# EAGLE design MetronomeSMD (EAGLE 6.1)
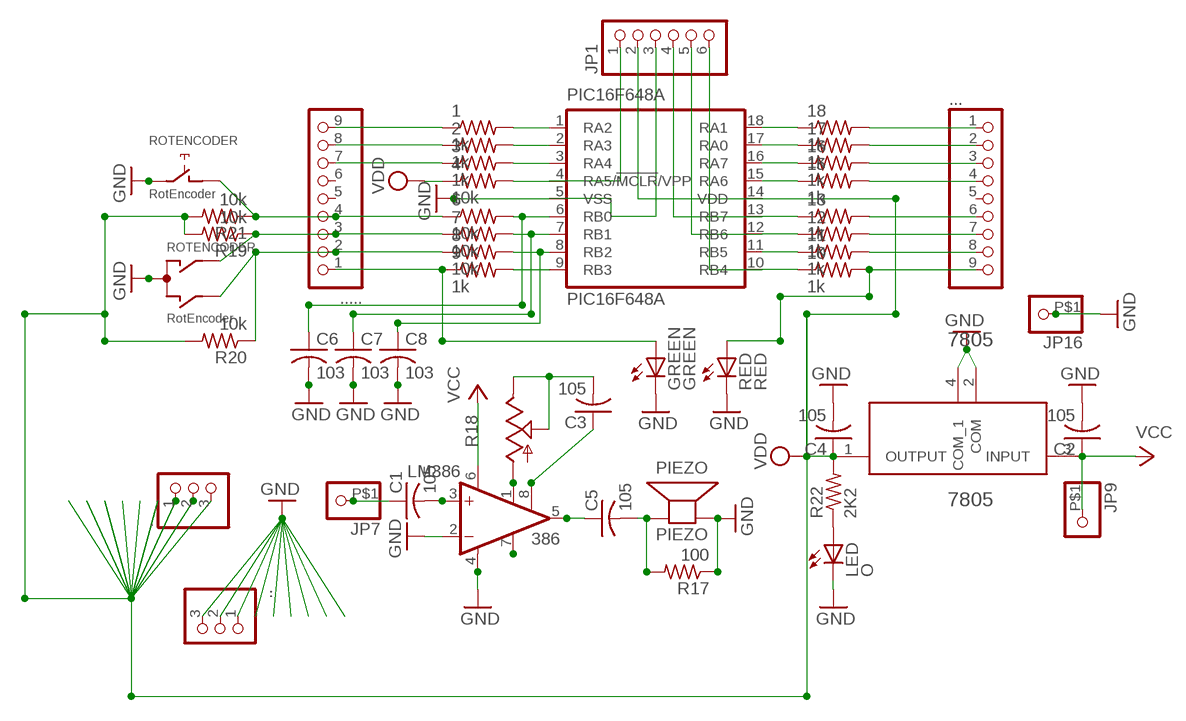
[diagram p0: schematic, sheet 1]

## Parts
1  1k  R-US_R1206  [R1206]
2  1k  R-US_R1206  [R1206]
3  1k  R-US_R1206  [R1206]
4  10k  R-US_R1206  [R1206]
6  10k  R-US_R1206  [R1206]
7  10k  R-US_R1206  [R1206]
8  10k  R-US_R1206  [R1206]
9  1k  R-US_R1206  [R1206]
10  1k  R-US_R1206  [R1206]
11  1k  R-US_R1206  [R1206]
12  1k  R-US_R1206  [R1206]
13  1k  R-US_R1206  [R1206]
15  1k  R-US_R1206  [R1206]
16  1k  R-US_R1206  [R1206]
17  1k  R-US_R1206  [R1206]
18  1k  R-US_R1206  [R1206]
7805  7805  UA78L05ACPKG3  [SOT150P400X160-4N]
.  PINHD-1X3CB  [1X03-CLEANBIG]
..  PINHD-1X3CB  [1X03-CLEANBIG]
...  PINHD-1X9  [1X09-BIG]
.....  PINHD-1X9  [1X09-BIG]
C1  105  C-USC1210  [C1210]
C2  105  C-USC1210  [C1210]
C3  105  C-USC1210  [C1210]
C4  105  C-USC1210  [C1210]
C5  105  C-USC1210  [C1210]
C6  103  C-USC1210  [C1210]
C7  103  C-USC1210  [C1210]
C8  103  C-USC1210  [C1210]
GREEN  GREEN  LED5MM  [LED5MM]
JP1  PINHD-1X6LOCK  [1X06-BIGLOCK]
JP7  PINHD-1X1-BIGPOGO  [1X1-BIGPOGO]
JP9  PINHD-1X1-BIGPOGO  [1X1-BIGPOGO]
JP16  PINHD-1X1-BIGPOGO  [1X1-BIGPOGO]
LED  O  LEDCHIPLED_1206  [CHIPLED_1206]
LM386  386  LM386M-1  [SO08]
PIC16F648A  PIC16F648A  PIC16F1826/27P  [DIL18]
PIEZO  PIEZO  SPEAKER/PS12  [PS12]
R17  100  R-US_R1206  [R1206]
R18  TRIM_US-RJ9W  [RJ9W]
R19  10k  R-US_R1206  [R1206]
R20  10k  R-US_R1206  [R1206]
R21  10k  R-US_R1206  [R1206]
R22  2K2  R-US_R1206  [R1206]
RED  RED  LED5MM  [LED5MM]
ROTENCODER  RotEncoder  EC12E_SW  [ALPS_EC12E_SW]

## Nets
GND: 7805.2(COM) 7805.4(COM_1) ...1 ...2 ...3 C2.2 C4.2 C6.2 C7.2 C8.2 GREEN.K(C) JP1.3 JP16.P$1 LED.C LM386.2(-IN) LM386.4(GND) PIC16F648A.5(VSS) PIEZO.P$2(-) R17.1 RED.K(C) ROTENCODER.C ROTENCODER.E
N$1: 9.2 PIC16F648A.9(RB3)
N$2: 1.2 PIC16F648A.1(RA2)
N$3: 2.2 PIC16F648A.2(RA3)
N$4: 3.2 PIC16F648A.3(RA4)
N$5: 4.2 JP1.1 PIC16F648A.4(RA5/!MCLR!/VPP)
N$6: 6.2 C6.1 PIC16F648A.6(RB0)
N$7: 7.2 C7.1 PIC16F648A.7(RB1)
N$8: 8.2 C8.1 PIC16F648A.8(RB2)
N$10: 1.1 ......9
N$11: 2.1 ......8
N$12: 3.1 ......7
N$14: 6.1 ......4 R21.1 ROTENCODER.D
N$15: 7.1 ......3 R19.1 ROTENCODER.A
N$16: 8.1 ......2 R20.1 ROTENCODER.B
N$17: 9.1 ......1 GREEN.A
N$18: 18.1 PIC16F648A.18(RA1)
N$19: 17.1 PIC16F648A.17(RA0)
N$20: 16.1 PIC16F648A.16(RA7)
N$21: 15.1 PIC16F648A.15(RA6)
N$22: 13.1 JP1.4 PIC16F648A.13(RB7)
N$23: C3.1 LM386.8(GAIN)
N$24: 12.1 JP1.5 PIC16F648A.12(RB6)
N$25: LM386.1(GAIN) R18.A
N$26: 11.1 PIC16F648A.11(RB5)
N$27: 10.1 JP1.6 PIC16F648A.10(RB4)
N$28: 18.2 ....1
N$29: 17.2 ....2
N$30: 16.2 ....3
N$31: 15.2 ....4
N$32: 13.2 ....6
N$33: C3.2 R18.E R18.S
N$34: 12.2 ....7
N$35: C1.2 LM386.3(+IN)
N$36: C5.1 LM386.5(OUT)
N$37: 11.2 ....8
N$38: 10.2 ....9 RED.A
N$39: C5.2 PIEZO.P$1(+) R17.2
N$40: LED.A R22.1
N$85: C1.1 JP7.P$1
N$102: LM386.7(BYPASS)
VCC: 7805.3(INPUT) C2.1 JP9.P$1 LM386.6(VS)
VDD: 4.1 7805.1(OUTPUT) ..1 ..2 ..3 C4.1 JP1.2 PIC16F648A.14(VDD) R19.2 R20.2 R21.2 R22.2
Unconnected: ....5 ......5 ......6 ROTENCODER.GND1(G) ROTENCODER.GND2(G)

## Library data of the parts
1-4 6-13 15-18 R17 R19-R22 = resistor:R-US_: RESISTOR, American symbol
7805 = TI-Eagle_library:UA78L05: μA78L00 SERIES POSITIVE-VOLTAGE REGULATORS,SOT-89-3; MPN: UA78L05ACPKG3; OC_FARNELL: 1236590; OC_NEWARK: 13M5626; PACKAGE: SOT-89-3; SUPPLIER: TEXAS INSTRUMENTS
. .. = adafruit:PINHD-1X3: PIN HEADER
... ..... = adafruit:PINHD-1X9: Pin header 1x10 0.1" spacing With round pins
C1-C8 = adafruit:C-US: CAPACITOR, American symbol
GREEN LED RED = adafruit:LED: LED OSRAM: - CHIPLED LG R971, LG N971, LY N971, LG Q971, LY Q971, LO R971, LY R971 LH N974, LH R974 LS Q976, LO Q976, LY Q976 LO Q996 - Hyper CHIPLED LW Q18S LB Q993, LB Q99A, LB R99A - SideLED LS A670, LO A670, LY A670, LG A670, LP A670 LB A673, LV A673, LT A673, LW A673 LH A674 LY A675 LS A676, LA A676, LO A676, LY A676, LW A676 LS A679, LY A679, LG A679 - Hyper Micro SIDELED® LS Y876, LA Y876, LO Y876, LY Y876 LT Y87S - SmartLED LW L88C, LW L88S LB L89C, LB L89S, LG L890 LS L89K, LO L89K, LY L89K LS L896, LA L896, LO L896, LY L896 - TOPLED LS T670, LO T670, LY T670, LG T670, LP T670 LSG T670, LSP T670, LSY T670, LOP T670, LYG T670 LG T671, LOG T671, LSG T671 LB T673, LV T673, LT T673, LW T673 LH T674 LS T676, LA T676, LO T676, LY T676, LB T676, LH T676, LSB T676, LW T676 LB T67C, LV T67C, LT T67C, LS T67K, LO T67K, LY T67K, LW E67C LS E67B, LA E67B, LO E67B, LY E67B, LB E67C, LV E67C, LT E67C LW T67C LS T679, LY T679, LG T679 LS T770, LO T770, LY T770, LG T770, LP T770 LB T773, LV T773, LT T773, LW T773 LH T774 LS E675, LA E675, LY E675, LS T675 LS T776, LA T776, LO T776, LY T776, LB T776 LHGB T686 LT T68C, LB T68C - Hyper Mini TOPLED® LB M676 - Mini TOPLED Santana® LG M470 LS M47K, LO M47K, LY M47K Source: http://www.osram.convergy.de/
JP1 = adafruit:PINHD-1X6: PIN HEADER
JP7 JP9 JP16 = adafruit:PINHD-1X1: Pin header 1x1 for 0.1" spacing With round pins
LM386 = linear:LM386?-*: Low Voltage Audio Power Amplifier Source: http://cache.national.com/ds/LM/LM386.pdf
PIC16F648A = microchip:PIC16*F1826/27: 18/20/28-Pin Flash Microcontrollers with nanoWatt XLP Technology Source: www.microchip.com PIC16F1827.pdf
PIEZO = adafruit:SPEAKER: SPEAKER Source: Buerklin Added PS12 (for part # PS1240 piezo) http://www.ladyada.net/library/pcb/eaglelibrary.html
R18 = pot:TRIM_US-: POTENTIOMETER
ROTENCODER = switch-alps:EC12E_SW: ALPS rotary Encoder EC12E series with switch; MPN: EC12E2424407; OC_FARNELL: 1520813; OC_NEWARK: 74M1068

## Board
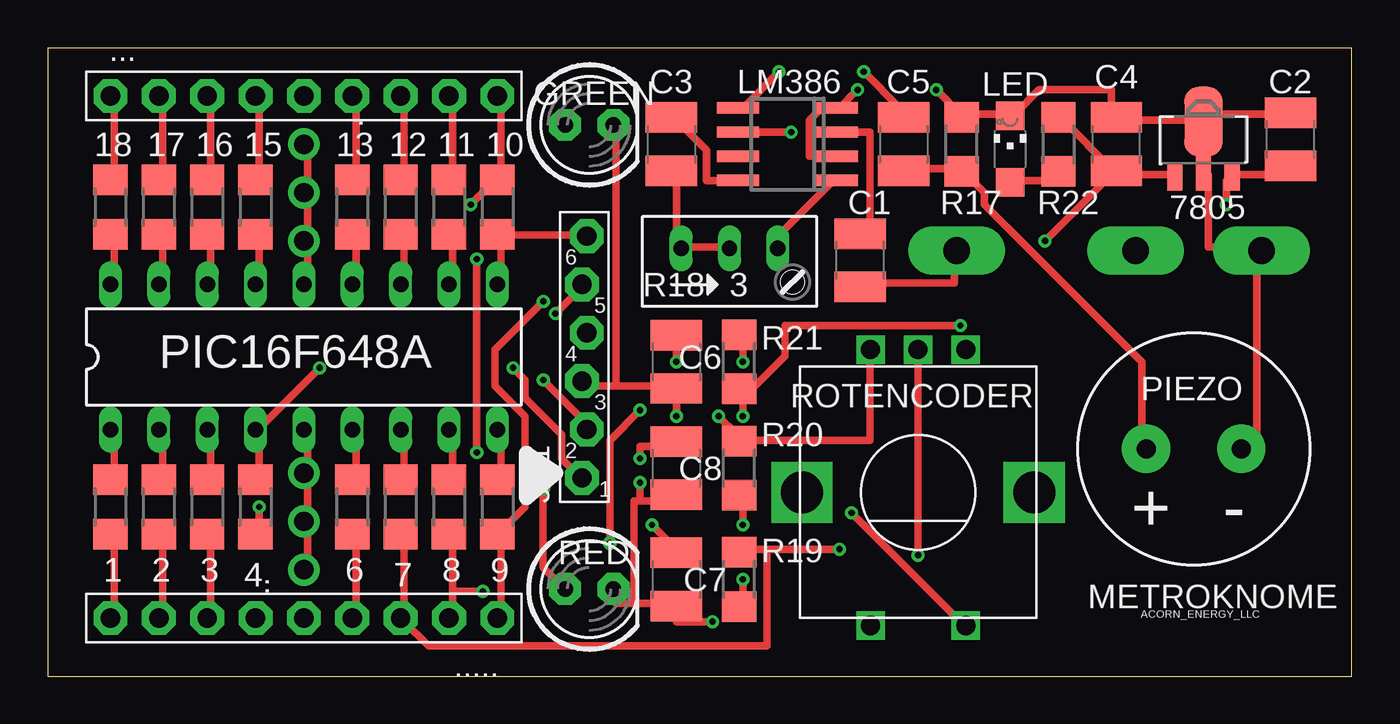
[diagram p1: board, top side]
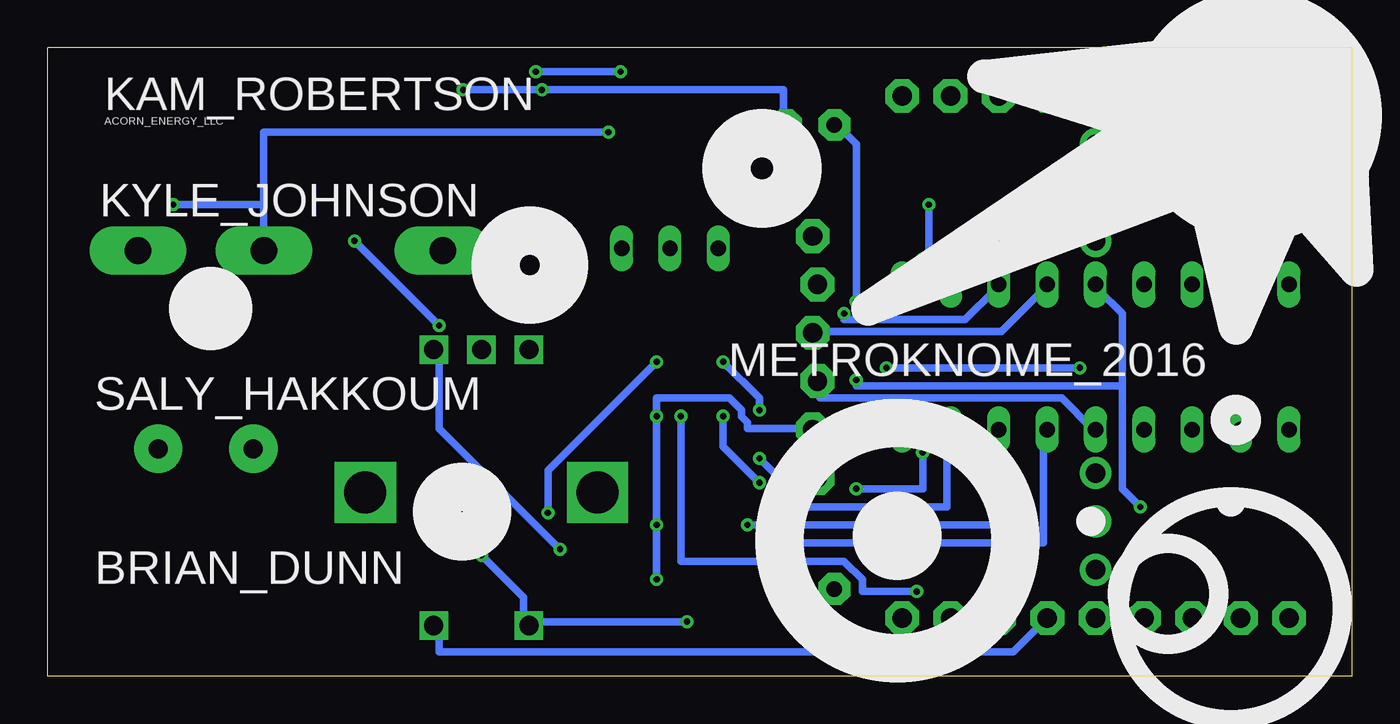
[diagram p2: board, bottom side, seen from below]

Size 68.5 x 33.02 mm. Coordinates in mm from the lower left corner, seen from the top.
Outline: 0,33.01 0,0
Outline: 0.01,0 68.5,0 68.5,33.02 0.01,33.02
Copper layers (1*16): Top 0.0356mm / dielectric 1.5011mm / Bottom 0.0356mm
Design rules: minimum track width 16mil, minimum drill 13mil, track to track 6mil, track to pad 6mil, pad to pad 6mil, via to via 6mil, smd to smd 6mil, copper to edge 15mil, drill to drill 6mil, minimum pad ring 7mil, minimum via ring 7mil, stop-mask expansion 2.5mil, vias tented up to drill 0mil, thermal gap 10mil

### Footprints (pad centres in the part's own frame; a part is rotated, then mirrored left to right if it is on the bottom)
R1206 = smd 1.6 x 1.803: 1 -1.422,0; 2 1.422,0
SOT150P400X160-4N = smd 0.8 x 1.4: 1 -1.499,-1.981; 3 1.499,-1.981 | smd 0.8 x 1.9: 2 0,-1.727 | smd 2.032 x 3.65: 4 0,0.94
1X03-CLEANBIG = drill 1.016 pad 1.676: 1 -2.54,0; 2 0,0; 3 2.54,0
1X09-BIG = drill 1.016 pad 1.778 octagon: 1 -10.16,0; 2 -7.62,0; 3 -5.08,0; 4 -2.54,0; 5 0,0; 6 2.54,0; 7 5.08,0; 8 7.62,0; 9 10.16,0
C1210 = smd 1.6 x 2.7: 1 -1.4,0; 2 1.4,0
LED5MM = drill 0.813 pad 1.676 octagon: A -1.27,0; K 1.27,0
1X06-BIGLOCK = drill 1.016 pad 1.778 octagon: 1 -6.35,0.127; 2 -3.81,-0.127; 3 -1.27,0.127; 4 1.27,-0.127; 5 3.81,0.127; 6 6.35,-0.127
1X1-BIGPOGO = drill 1.4 pad 2.54 long: P$1 0,0
CHIPLED_1206 = smd 1.5 x 1.5: A 0,-1.75; C 0,1.75
SO08 = smd 0.6 x 2.2: 1 -1.905,-2.6; 2 -0.635,-2.6; 3 0.635,-2.6; 4 1.905,-2.6; 5 1.905,2.6; 6 0.635,2.6; 7 -0.635,2.6; 8 -1.905,2.6
DIL18 = drill 0.813 long: 1 -10.16,-3.81; 2 -7.62,-3.81; 3 -5.08,-3.81; 4 -2.54,-3.81; 5 0,-3.81; 6 2.54,-3.81; 7 5.08,-3.81; 8 7.62,-3.81; 9 10.16,-3.81; 10 10.16,3.81; 11 7.62,3.81; 12 5.08,3.81; 13 2.54,3.81; 14 0,3.81; 15 -2.54,3.81; 16 -5.08,3.81; 17 -7.62,3.81; 18 -10.16,3.81
PS12 = drill 1 pad 2.54: P$1 -2.5,0; P$2 2.5,0
RJ9W = drill 0.813 long: A 2.54,0.635; E -2.54,0.635; S 0,0.635
ALPS_EC12E_SW = drill 1 square: A -2.5,-7.5; B 2.5,-7.5; C 0,-7.5; D -2.5,7; E 2.5,7 | drill 2.2 square: GND1 -6.1,0; GND2 6.1,0

### Placement (x,y rotation side)
1  3.3,8.89 90 top
2  5.84,8.89 90 top
3  8.38,8.89 90 top
4  10.92,8.89 90 top
6  16,8.89 90 top
7  18.54,8.89 90 top
8  21.08,8.89 90 top
9  23.62,8.89 90 top
10  23.62,24.64 90 top
11  21.08,24.64 90 top
12  18.54,24.64 90 top
13  16,24.64 90 top
15  10.92,24.64 90 top
16  8.38,24.64 90 top
17  5.84,24.64 90 top
18  3.3,24.64 90 top
7805  60.71,28.19 0 top
.  13.46,25.4 270 top
..  13.46,8.13 90 top
...  13.46,30.48 0 top
.....  13.46,3.05 180 top
C1  42.67,21.84 90 top
C2  65.28,28.19 90 top
C3  32.77,27.94 270 top
C4  56.13,27.94 90 top
C5  44.96,27.94 270 top
C6  33.02,16.51 270 top
C7  33.02,5.08 270 top
C8  33.02,10.92 270 top
GREEN  28.45,28.96 0 top
JP1  28.19,16.76 90 top
JP7  47.75,22.35 180 top
JP9  57.15,22.35 0 top
JP16  63.75,22.35 180 top
LED  50.55,27.69 0 top
LM386  38.86,27.94 90 top
PIC16F648A  13.46,16.76 0 top
PIEZO  60.2,11.94 0 top
R17  48.01,27.94 270 top
R18  35.81,21.84 0 top
R19  36.32,5.08 270 top
R20  36.32,10.92 270 top
R21  36.32,16.51 270 top
R22  53.09,27.94 90 top
RED  28.45,4.57 0 top
ROTENCODER  45.72,9.65 180 top

### Tracks (layer width: path | path; a pad name or v marks a point on that pad's centre or on a via)
GND  (via drill 0.33)
  Top 0.406: PIEZO.P$2 62.87,12.06 63.5,12.7 63.5,22.23 JP16.P$1 | JP16.P$1 63.82,22.23 JP16.P$1 | 7805.4 60.64,28.89 60.64,26.67 7805.2 60.96,26.35 60.96,22.54 63.5,22.54 JP16.P$1 | C2.2 65.09,29.53 60.96,29.53 60.96,29.21 7805.4 | LM386.2 41.27,27.3 40.01,27.3 40.01,29.21 40.64,29.84 41.27,29.84 LM386.4 41.59,29.84 v42.55,30.8 | 48.26,29.53 50.48,29.53 LED.C 50.8,29.53 52.07,30.8 55.88,30.8 55.88,29.53 C4.2 56.2,29.21 60.64,29.21 7805.4 | 48.26,29.53 R17.1 | 48.26,29.53 R17.1 | 48.26,29.53 R17.1 | v46.67,30.8 47.94,29.53 R17.1 | 30.8,3.81 29.84,3.81 29.84,4.45 RED.K | 30.8,3.81 33.02,3.81 C7.2 33.02,3.49 33.02,2.86 v34.92,2.86 | 31.11,9.21 30.8,9.21 30.8,3.81 | 31.11,9.21 33.02,9.21 C8.2 | v45.72,6.35 ROTENCODER.C | PIC16F648A.5 13.65,12.7 13.65,10.79 ...3 13.65,10.48 13.65,8.26 ...2 13.65,7.94 13.65,5.71 ...1 | 29.84,15.24 28.26,15.24 JP1.3 | 29.84,15.24 33.02,15.24 C6.2 33.02,14.92 v33.02,13.65 | 29.84,15.24 29.84,28.89 GREEN.K | v31.11,10.16 31.11,9.21
  Bottom 0.406: v46.67,30.8 v42.55,30.8 29.84,30.8 29.84,29.21 GREEN.K | v34.92,2.86 43.18,2.86 ROTENCODER.E 43.5,2.86 43.5,4.13 v45.72,6.35 | PIC16F648A.5 13.65,13.02 15.24,14.61 27.94,14.61 27.94,15.24 JP1.3 | v31.11,10.16 33.02,12.06 v33.02,13.65
N$1
  Top 0.406: 9.2 23.81,10.48 23.81,12.7 PIC16F648A.9
N$2
  Top 0.406: 1.2 3.49,10.48 3.49,12.7 PIC16F648A.1
N$3
  Top 0.406: 2.2 6.03,10.48 6.03,12.7 PIC16F648A.2
N$4
  Top 0.406: 3.2 8.57,10.48 8.57,12.7 PIC16F648A.3
N$5  (via drill 0.33)
  Top 0.406: 4.2 11.11,10.48 11.11,12.7 PIC16F648A.4 11.11,13.02 v14.29,16.19 | v24.45,16.19 25.08,15.56 25.08,14.61 26.99,12.7 26.99,11.43 27.94,10.48 JP1.1
  Bottom 0.406: v24.45,16.19 v14.29,16.19
N$6  (via drill 0.33)
  Top 0.406: 6.2 16.19,10.48 16.19,12.7 PIC16F648A.6 | v33.02,16.51 33.02,17.78 C6.1 | v31.11,13.97 29.53,12.38 v29.53,6.99
  Bottom 0.406: v33.02,16.51 31.11,14.61 v31.11,13.97 | v29.53,6.99 16.19,6.99 16.19,12.7 PIC16F648A.6
N$7  (via drill 0.33)
  Top 0.406: 7.2 18.73,10.48 18.73,12.7 PIC16F648A.7 | v31.75,7.94 33.02,6.67 C7.1
  Bottom 0.406: v31.75,7.94 18.73,7.94 18.73,12.7 PIC16F648A.7
N$8  (via drill 0.33)
  Top 0.406: 8.2 21.27,10.48 21.27,12.7 PIC16F648A.8 | v31.11,11.43 31.11,12.06 33.02,12.06 C8.1
  Bottom 0.406: v31.11,11.43 28.57,8.89 21.27,8.89 21.27,12.7 PIC16F648A.8
N$10
  Top 0.406: 1.1 3.49,7.3 3.49,3.17 ......9
N$11
  Top 0.406: 2.1 6.03,7.3 6.03,3.17 ......8
N$12
  Top 0.406: 3.1 8.57,7.3 8.57,3.17 ......7
N$14  (via drill 0.33)
  Top 0.406: 6.1 16.19,7.3 16.19,3.17 ......4 | v36.51,16.51 36.51,17.78 R21.1 | v42.23,8.57 47.94,2.86 ROTENCODER.D
  Bottom 0.406: v36.51,16.51 42.23,10.79 v42.23,8.57 | ......4 16.19,2.86 17.78,1.27 47.94,1.27 47.94,2.54 ROTENCODER.D
N$15  (via drill 0.33)
  Top 0.406: 7.1 18.73,7.3 18.73,3.17 ......3 18.73,2.86 20,1.59 37.78,1.59 37.78,6.67 | v41.59,6.67 37.78,6.67 | 37.78,6.67 36.51,6.67 R19.1
  Bottom 0.406: v41.59,6.67 47.94,13.02 47.94,17.14 ROTENCODER.A
N$16  (via drill 0.33)
  Top 0.406: 21.27,4.45 21.27,3.17 ......2 | 21.27,4.45 21.27,7.3 8.1 | ROTENCODER.B 43.18,17.14 43.18,12.38 36.51,12.38 R20.1 36.2,12.38 36.2,12.7 v35.24,13.65 | v22.86,4.45 21.27,4.45
  Bottom 0.406: v22.86,4.45 25.72,4.45 25.72,5.08 26.67,6.03 35.24,6.03 v35.24,13.65
N$17  (via drill 0.33)
  Top 0.406: ......1 23.81,3.17 23.81,7.3 9.1 23.81,7.62 25.08,8.89 25.08,13.65 23.5,15.24 23.5,17.14 v26.04,19.68
  Bottom 0.406: v26.04,19.68 26.04,27.94 26.99,28.89 GREEN.A
N$18
  Top 0.406: 18.1 3.49,23.18 3.49,20.64 PIC16F648A.18
N$19
  Top 0.406: 17.1 6.03,23.18 6.03,20.64 PIC16F648A.17
N$20
  Top 0.406: 16.1 8.57,23.18 8.57,20.64 PIC16F648A.16
N$21
  Top 0.406: 15.1 11.11,23.18 11.11,20.64 PIC16F648A.15
N$22
  Top 0.406: 13.1 16.19,23.18 16.19,20.64 PIC16F648A.13
  Bottom 0.406: PIC16F648A.13 16.19,20.32 18.41,18.1 28.26,18.1 JP1.4
N$23
  Top 0.406: LM386.8 36.2,26.04 34.61,26.04 34.61,27.62 33.02,29.21 C3.1
N$24  (via drill 0.33)
  Top 0.406: 12.1 18.73,23.18 18.73,20.64 PIC16F648A.12 | v26.67,19.05 27.94,20.32 JP1.5
  Bottom 0.406: v26.67,19.05 26.67,18.73 20.32,18.73 18.73,20.32 PIC16F648A.12
N$25
  Top 0.406: LM386.1 41.27,26.04 38.42,23.18 38.42,22.54 R18.A
N$26
  Top 0.406: 11.1 21.27,23.18 21.27,20.64 PIC16F648A.11
N$27
  Top 0.406: 23.81,23.18 23.81,20.64 PIC16F648A.10 | 23.81,23.18 10.1 23.81,23.18 | 23.81,23.18 28.26,23.18 JP1.6
N$28
  Top 0.406: 18.2 3.49,26.35 3.49,30.48 ....1
N$29
  Top 0.406: 17.2 6.03,26.35 6.03,30.48 ....2
N$30
  Top 0.406: 16.2 8.57,26.35 8.57,30.48 ....3
N$31
  Top 0.406: 15.2 11.11,26.35 11.11,30.48 ....4
N$32
  Top 0.406: 13.2 16.19,26.35 16.19,30.48 ....6
N$33
  Top 0.406: R18.S 35.56,22.54 33.34,22.54 R18.E 33.02,22.54 33.02,26.35 C3.2
N$34
  Top 0.406: 12.2 18.73,26.35 18.73,30.48 ....7
N$35
  Top 0.406: LM386.3 41.59,28.57 43.18,28.57 43.18,23.81 42.86,23.5 C1.2
N$36  (via drill 0.33)
  Top 0.406: v38.42,31.75 36.51,29.84 LM386.5 | v42.86,31.75 44.77,29.84 44.77,29.53 C5.1
  Bottom 0.406: v42.86,31.75 v38.42,31.75
N$37
  Top 0.406: 11.2 21.27,26.35 21.27,30.48 ....8
N$38  (via drill 0.33)
  Top 0.406: ....9 23.81,30.48 23.81,26.35 10.2 23.5,26.04 v22.23,24.77 | v26.04,9.84 26.04,5.71 26.99,4.76 RED.A | v22.54,21.91 v22.54,11.75
  Bottom 0.406: v26.04,9.84 22.54,9.84 v22.54,11.75 | v22.54,21.91 22.23,22.23 v22.23,24.77
N$39
  Top 0.406: R17.2 48.26,26.67 R17.2 | R17.2 47.94,26.67 45.09,26.67 C5.2 | R17.2 48.26,26.35 49.21,25.4 49.21,24.77 57.47,16.51 57.47,12.06 PIEZO.P$1
N$40
  Top 0.406: LED.A 50.8,26.04 53.02,26.04 53.02,26.35 R22.1
N$85
  Top 0.406: C1.1 42.86,20.64 47.62,20.64 47.62,22.23 JP7.P$1
VCC  (via drill 0.33)
  Top 0.406: C2.1 65.09,26.67 65.09,26.35 62.23,26.35 7805.3 61.91,26.04 v61.91,24.77 | v39.05,28.57 36.51,28.57 LM386.6
  Bottom 0.406: v39.05,28.57 57.15,28.57 57.15,24.77 | 57.15,24.77 57.15,22.54 JP9.P$1 | 57.15,24.77 v61.91,24.77
VDD  (via drill 0.33)
  Top 0.406: 13.65,25.4 13.65,27.94 ..1 | 13.65,25.4 ..2 13.65,25.4 | v11.11,8.89 11.11,7.62 4.1 | 13.65,20.64 PIC16F648A.14 | 13.65,20.64 PIC16F648A.14 | 13.65,20.64 13.65,22.86 | 13.65,22.86 ..3 13.65,22.86 | 13.65,20.64 PIC16F648A.14 | 13.65,22.86 13.65,25.4 | R22.2 53.34,29.53 R22.2 | 7805.1 59.05,26.35 56.2,26.35 C4.1 | R22.2 53.34,29.21 55.88,26.67 C4.1 | v36.51,5.08 36.51,3.81 R19.2 | v36.51,7.94 36.51,9.21 R20.2 | v36.51,13.65 36.51,14.61 | 36.51,14.61 36.51,14.92 R21.2 36.51,14.61 | v52.39,22.86 55.88,26.35 C4.1 | v47.94,18.41 38.73,18.41 38.73,16.83 36.51,14.61 | v26.04,15.56 28.26,13.34 28.26,13.02 JP1.2
  Bottom 0.406: v11.11,8.89 12.06,9.84 12.06,15.24 | 12.06,15.24 12.06,19.05 13.34,20.32 PIC16F648A.14 | v36.51,5.08 v36.51,7.94 v36.51,13.65 36.51,14.61 32.7,14.61 32.07,13.97 32.07,13.65 31.75,13.34 31.75,13.02 28.57,13.02 JP1.2 | v47.94,18.41 v52.39,22.86 | 12.06,15.24 26.04,15.24 v26.04,15.56

### Text on the board
tPlace: 6 | 5 | 4 | 3 | 2 | 1 | + | - | METROKNOME | ACORN_ENERGY_LLC
bPlace: KAM_ROBERTSON | ACORN_ENERGY_LLC | KYLE_JOHNSON | METROKNOME_2016 | SALY_HAKKOUM | BRIAN_DUNN